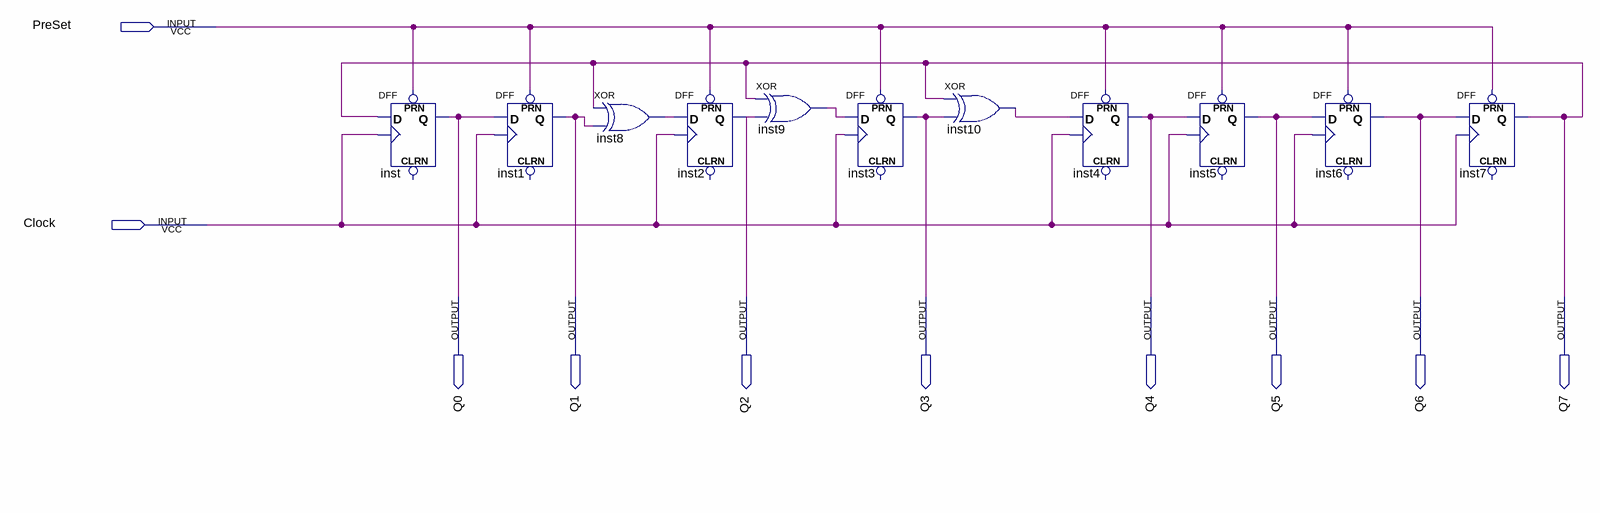
[diagram p0: schematic sheet]
// Quartus schematic BrandNewLSFR.bdf as structural Verilog: 11 symbols, 10 pins
module BrandNewLSFR (
  input  PreSet,
  input  Clock,
  output Q0,
  output Q1,
  output Q2,
  output Q3,
  output Q4,
  output Q5,
  output Q6,
  output Q7
);

  wire inst8_out, inst9_out, inst10_out;

  DFF inst (.CLK(Clock), .D(Q7), .PRN(PreSet), .Q(Q0));  // open: CLRN
  DFF inst1 (.CLK(Clock), .D(Q0), .PRN(PreSet), .Q(Q1));  // open: CLRN
  xor inst8 (inst8_out, Q7, Q1);
  DFF inst2 (.CLK(Clock), .D(inst8_out), .PRN(PreSet), .Q(Q2));  // open: CLRN
  xor inst9 (inst9_out, Q7, Q2);
  DFF inst3 (.CLK(Clock), .D(inst9_out), .PRN(PreSet), .Q(Q3));  // open: CLRN
  xor inst10 (inst10_out, Q7, Q3);
  DFF inst4 (.CLK(Clock), .D(inst10_out), .PRN(PreSet), .Q(Q4));  // open: CLRN
  DFF inst5 (.CLK(Clock), .D(Q4), .PRN(PreSet), .Q(Q5));  // open: CLRN
  DFF inst6 (.CLK(Clock), .D(Q5), .PRN(PreSet), .Q(Q6));  // open: CLRN
  DFF inst7 (.CLK(Clock), .D(Q6), .PRN(PreSet), .Q(Q7));  // open: CLRN
endmodule
